# Altium schematic sheet NO2-CO2 Sensor.SchDoc
size D; SheetNumber: 1; SheetTotal: 1; SPICEModelCacheXTSNYQXE: <root> / <DocumentId>XTSNYQXE</DocumentId> / </root>
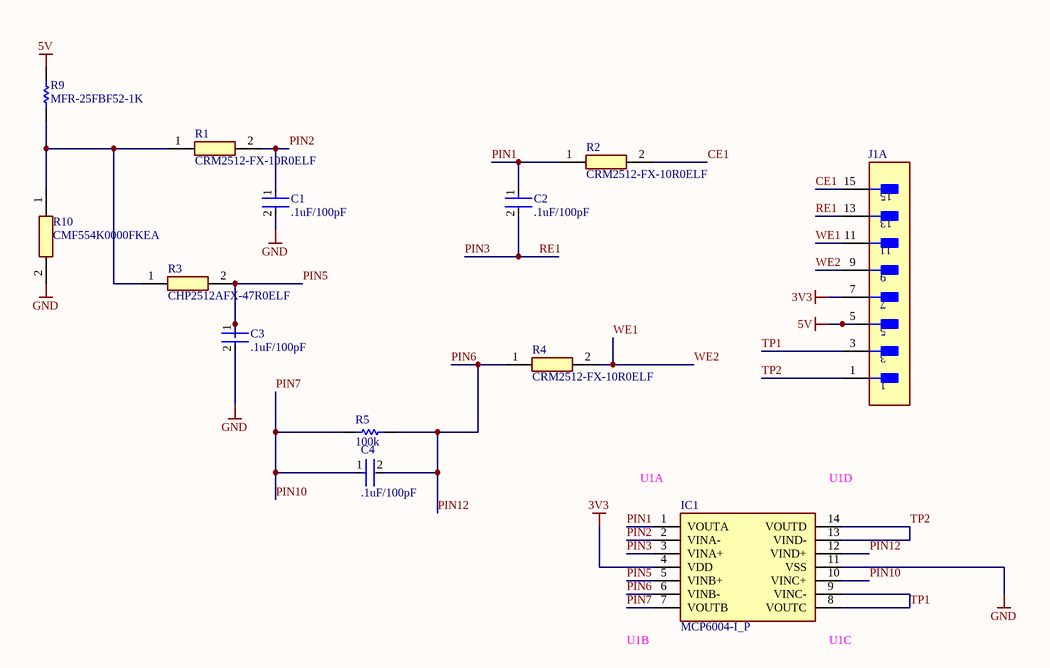
[diagram p0: NO2-CO2 Sensor.SchDoc]

## Parts
C1  .1uF/100pF  [FP-RCE0DB-MFG]
C2  .1uF/100pF  [FP-RCE0DB-MFG]
C3  .1uF/100pF  [FP-RCE0DB-MFG]
C4  .1uF/100pF  [FP-RCE0DB-MFG]
IC1  MCP6004-I_P  [DIP794W56P254L1905H432Q14N]
J1  (no value)  [FP-87227-8-MFG]  (part A of 2)
R1  CRM2512-FX-10R0ELF  [RESC6331X80N]
R2  CRM2512-FX-10R0ELF  [RESC6331X80N]
R3  CHP2512AFX-47R0ELF  [RESC6431X130N]
R4  CRM2512-FX-10R0ELF  [RESC6331X80N]
R5  100k  [RESA60-630X240]
R9  MFR-25FBF52-1K  [RESA60-630X240]
R10  CMF554K0000FKEA  [RESAD1526W69L610D229]

## Nets
3V3: IC1.4(VDD) J1.7
5V: J1.5 R9.2
GND: C1.2 C3.2 IC1.11(VSS) R10.2
CE1: J1.15 R2.2
PIN1: C2.1 IC1.1(VOUTA) R2.1
PIN2: C1.1 IC1.2(VINA-) R1.2
PIN3: C2.2 IC1.3(VINA+) J1.13  [also labelled RE1]
PIN5: C3.1 IC1.5(VINB+) R3.2
PIN10: C4.1 IC1.7(VOUTB) IC1.10(VINC+) R5.1  [also labelled PIN7]
PIN12: C4.2 IC1.6(VINB-) IC1.12(VIND+) R4.1 R5.2  [also labelled PIN6]
TP1: IC1.8(VOUTC) IC1.9(VINC-) J1.3
TP2: IC1.13(VIND-) IC1.14(VOUTD) J1.1
WE1: J1.9 J1.11 R4.2  [also labelled WE2]
NetR1_1: R1.1 R3.1 R9.1 R10.1

## Notes on the sheet
- (near IC1) U1A
- (near IC1) U1D
- (near IC1) U1B
- (near IC1) U1C

## Library data of the parts
C1-C4 = CMP-06035-022164-1: Cap Ceramic 100pF 100V C0G ±5% Radial 2.5mm +125°C Ammo Pack; Lead Diameter: 0.5mm; Lead/Base Style: Straight; Resistor Type: Ceramic; Termination: Radial; Voltage Rating: 100V; Height: 3.5mm; Min Operating Temperature: -55°C; Packaging: Tape and Reel; Lead Pitch: 0.098inch; Width: 0.098inch; Voltage Rating (DC): 100V; Tolerance: 5%; Capacitance: 100pF; Max Operating Temperature: 125°C; Dielectric: C0G; Height - Seated (Max): 0.138inch; Case/Package: Radial; Length: 0.142inch; Ratings: AEC-Q200; Mount: Through Hole; Package Quantity: 2000
IC1 = MCP6004-I_P: Integrated Circuit; Manufacturer_Name: Microchip; Manufacturer_Part_Number: MCP6004-I/P; Datasheet Link: http://componentsearchengine.com/Datasheets/1/MCP6004-I_P.pdf; Height: 4.32mm; Mouser Part Number: 579-MCP6004-I/P; Mouser Price/Stock: https://www.mouser.co.uk/ProductDetail/Microchip-Technology-Atmel/MCP6004-I-P?qs=VLwvNDPaIpqIfz2%252Bgie0oA%3D%3D; Arrow Part Number: MCP6004-I/P; Arrow Price/Stock: https://www.arrow.com/en/products/mcp6004-ip/microchip-technology?region=nac
J1 = CMP-03369-000064-1: CONN HEADER VERT 16POS 2.54MM; Manufacturer: TE Connectivity; Manufacturer Part Number: 87227-8; Conn Gender: Male; Conn Orientation: Straight; Current Rating: 3A; Number Of Contacts: 16; Mouser Description: Headers & Wire Housings UNSHRD VERT DUAL 16; Lead Free: Yes; Digikey Description: CONN HEADER VERT 16POS 2.54MM; Device Class L3: unset; Automotive: No; Height: 0.428inch; Temperature Range Low: -65°C; Device Class L1: Connectors; RoHS: TRUE; Pitch: 2.54mm; Package: 0; Number Of Rows: 2; Footprint Url: https://www.te.com/commerce/DocumentDelivery/DDEController?Action=showdoc&DocId=Customer+Drawing%7F87227%7FH4%7Fpdf%7FEnglish%7FENG_CD_87227_H4.pdf%7F87227-8; ComponentLink2URL: https://www.te.com/usa-en/product-87227-8.datasheet.pdf; ComponentLink2Description: Datasheet; Temperature: -65°C to +105°C; Category: Conn; Temperature Range High: +105°C; Octopart: https://octopart.com/87227-8-te+connectivity-39407754; Device Class L2: Headers and Wire Housings; Contact Material: Gold,Nickel
R1 R2 R4 = CRM2512-FX-10R0ELF: Resistor; Manufacturer_Name: Bourns; Datasheet Link: http://www.bourns.com/data/global/pdfs/CRM0805_1206_2010.pdf; Height: 0.8mm; Manufacturer_Part_Number: CRM2512-FX-10R0ELF; Mouser Part Number: 652-CRM2512FX10R0ELF; Mouser Price/Stock: https://www.mouser.co.uk/ProductDetail/Bourns/CRM2512-FX-10R0ELF?qs=9fn1gpisni4uwEopCkMdhg%3D%3D; Arrow Part Number: CRM2512-FX-10R0ELF; Arrow Price/Stock: https://www.arrow.com/en/products/crm2512-fx-10r0elf/bourns
R3 = CHP2512AFX-47R0ELF: Resistor; Manufacturer_Name: Bourns; Datasheet Link: https://www.bourns.com/products/resistors/thick-film-chip-resistors/product/CHP2512A; Height: 1.3mm; Manufacturer_Part_Number: CHP2512AFX-47R0ELF; Mouser Part Number: 652-CHP2512AFX-47R0L; Mouser Price/Stock: https://www.mouser.co.uk/ProductDetail/Bourns/CHP2512AFX-47R0ELF?qs=GedFDFLaBXGsr5kcmTJx%252BQ%3D%3D
R5 = CMP-1659-00073-1: Axial Resistor, 100 KOhm, +/- 1%, 0.25 W, -55 to 155 degC, 2-Pin THD, RoHS, Bulk; Voltage Rating: 250 V; Power Rating: 250 mW; Resistance: 475 Ohm; PackageDescription: 2-Pin Axial Lead, Dia 2.4 mm, Body Length 6.3 mm; PackageReference: MFR-25; Length: 0.248 inch; ComponentLink2Description: Datasheet; Packaging: Bulk; DatasheetVersion: Apr-13; Package Quantity: 200; Min Operating Temperature: -55 degC; ComponentLink2URL: http://www.yageo.com/documents/recent/Yageo%20LR_MFR_2013.pdf; RoHSCompliant: true; ComponentLink1URL: http://www.yageo.com/; Tolerance: 1%; Case\Package: Axial; Mount: Through Hole; ComponentLink1Description: Manufacturer URL; Max Operating Temperature: 155 degC
R9 = CMP-1659-00075-1: Axial Resistor, 1 KOhm, +/- 1%, 250 mW, -55 to 155 degC, 2-Pin THD, RoHS, Bulk; Voltage Rating: 250 V; Resistance: 10 kohm; Power Rating: 250 mW; ComponentLink2Description: Datasheet; RoHSCompliant: true; PackageReference: MFR-25; Case\Package: Axial; Max Operating Temperature: 155 degC; DatasheetVersion: Apr-13; Tolerance: 1%; ComponentLink1URL: http://www.yageo.com/; Length: 0.248 inch; ComponentLink2URL: http://www.yageo.com/documents/recent/Yageo%20LR_MFR_2013.pdf; Packaging: Bulk; Package Quantity: 200; PackageDescription: 2-Pin Axial Lead, Dia 2.4 mm, Body Length 6.3 mm; Min Operating Temperature: -55 degC; ComponentLink1Description: Manufacturer URL
R10 = CMF554K0000FKEA: Resistor; Manufacturer_Name: Vishay; Datasheet Link: https://componentsearchengine.com/Datasheets/1/CMF554K0000FKEA.pdf; Manufacturer_Part_Number: CMF554K0000FKEA; Mouser Part Number: 71-CMF554K0000FKEA; Mouser Price/Stock: https://www.mouser.com/Search/Refine.aspx?Keyword=71-CMF554K0000FKEA